# EAGLE schematic htk1087b (EAGLE 6.3)
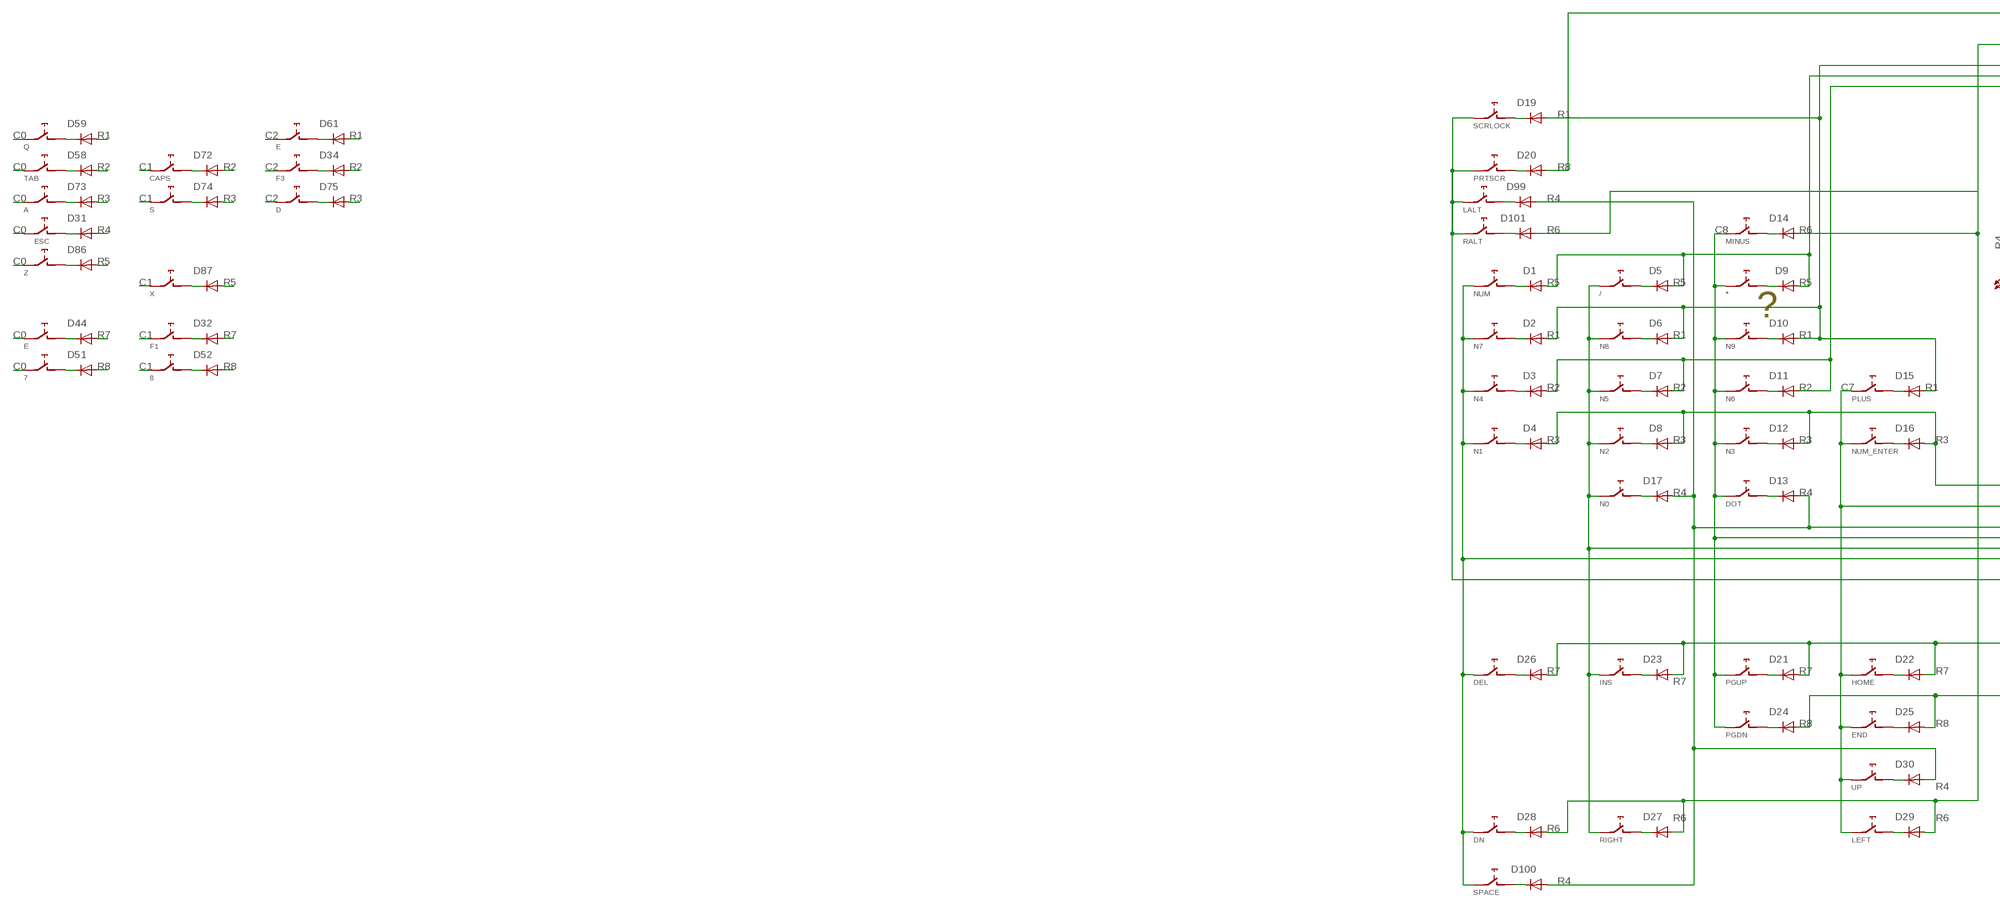
[diagram p0: schematic, sheet 1, part 1 of 2]
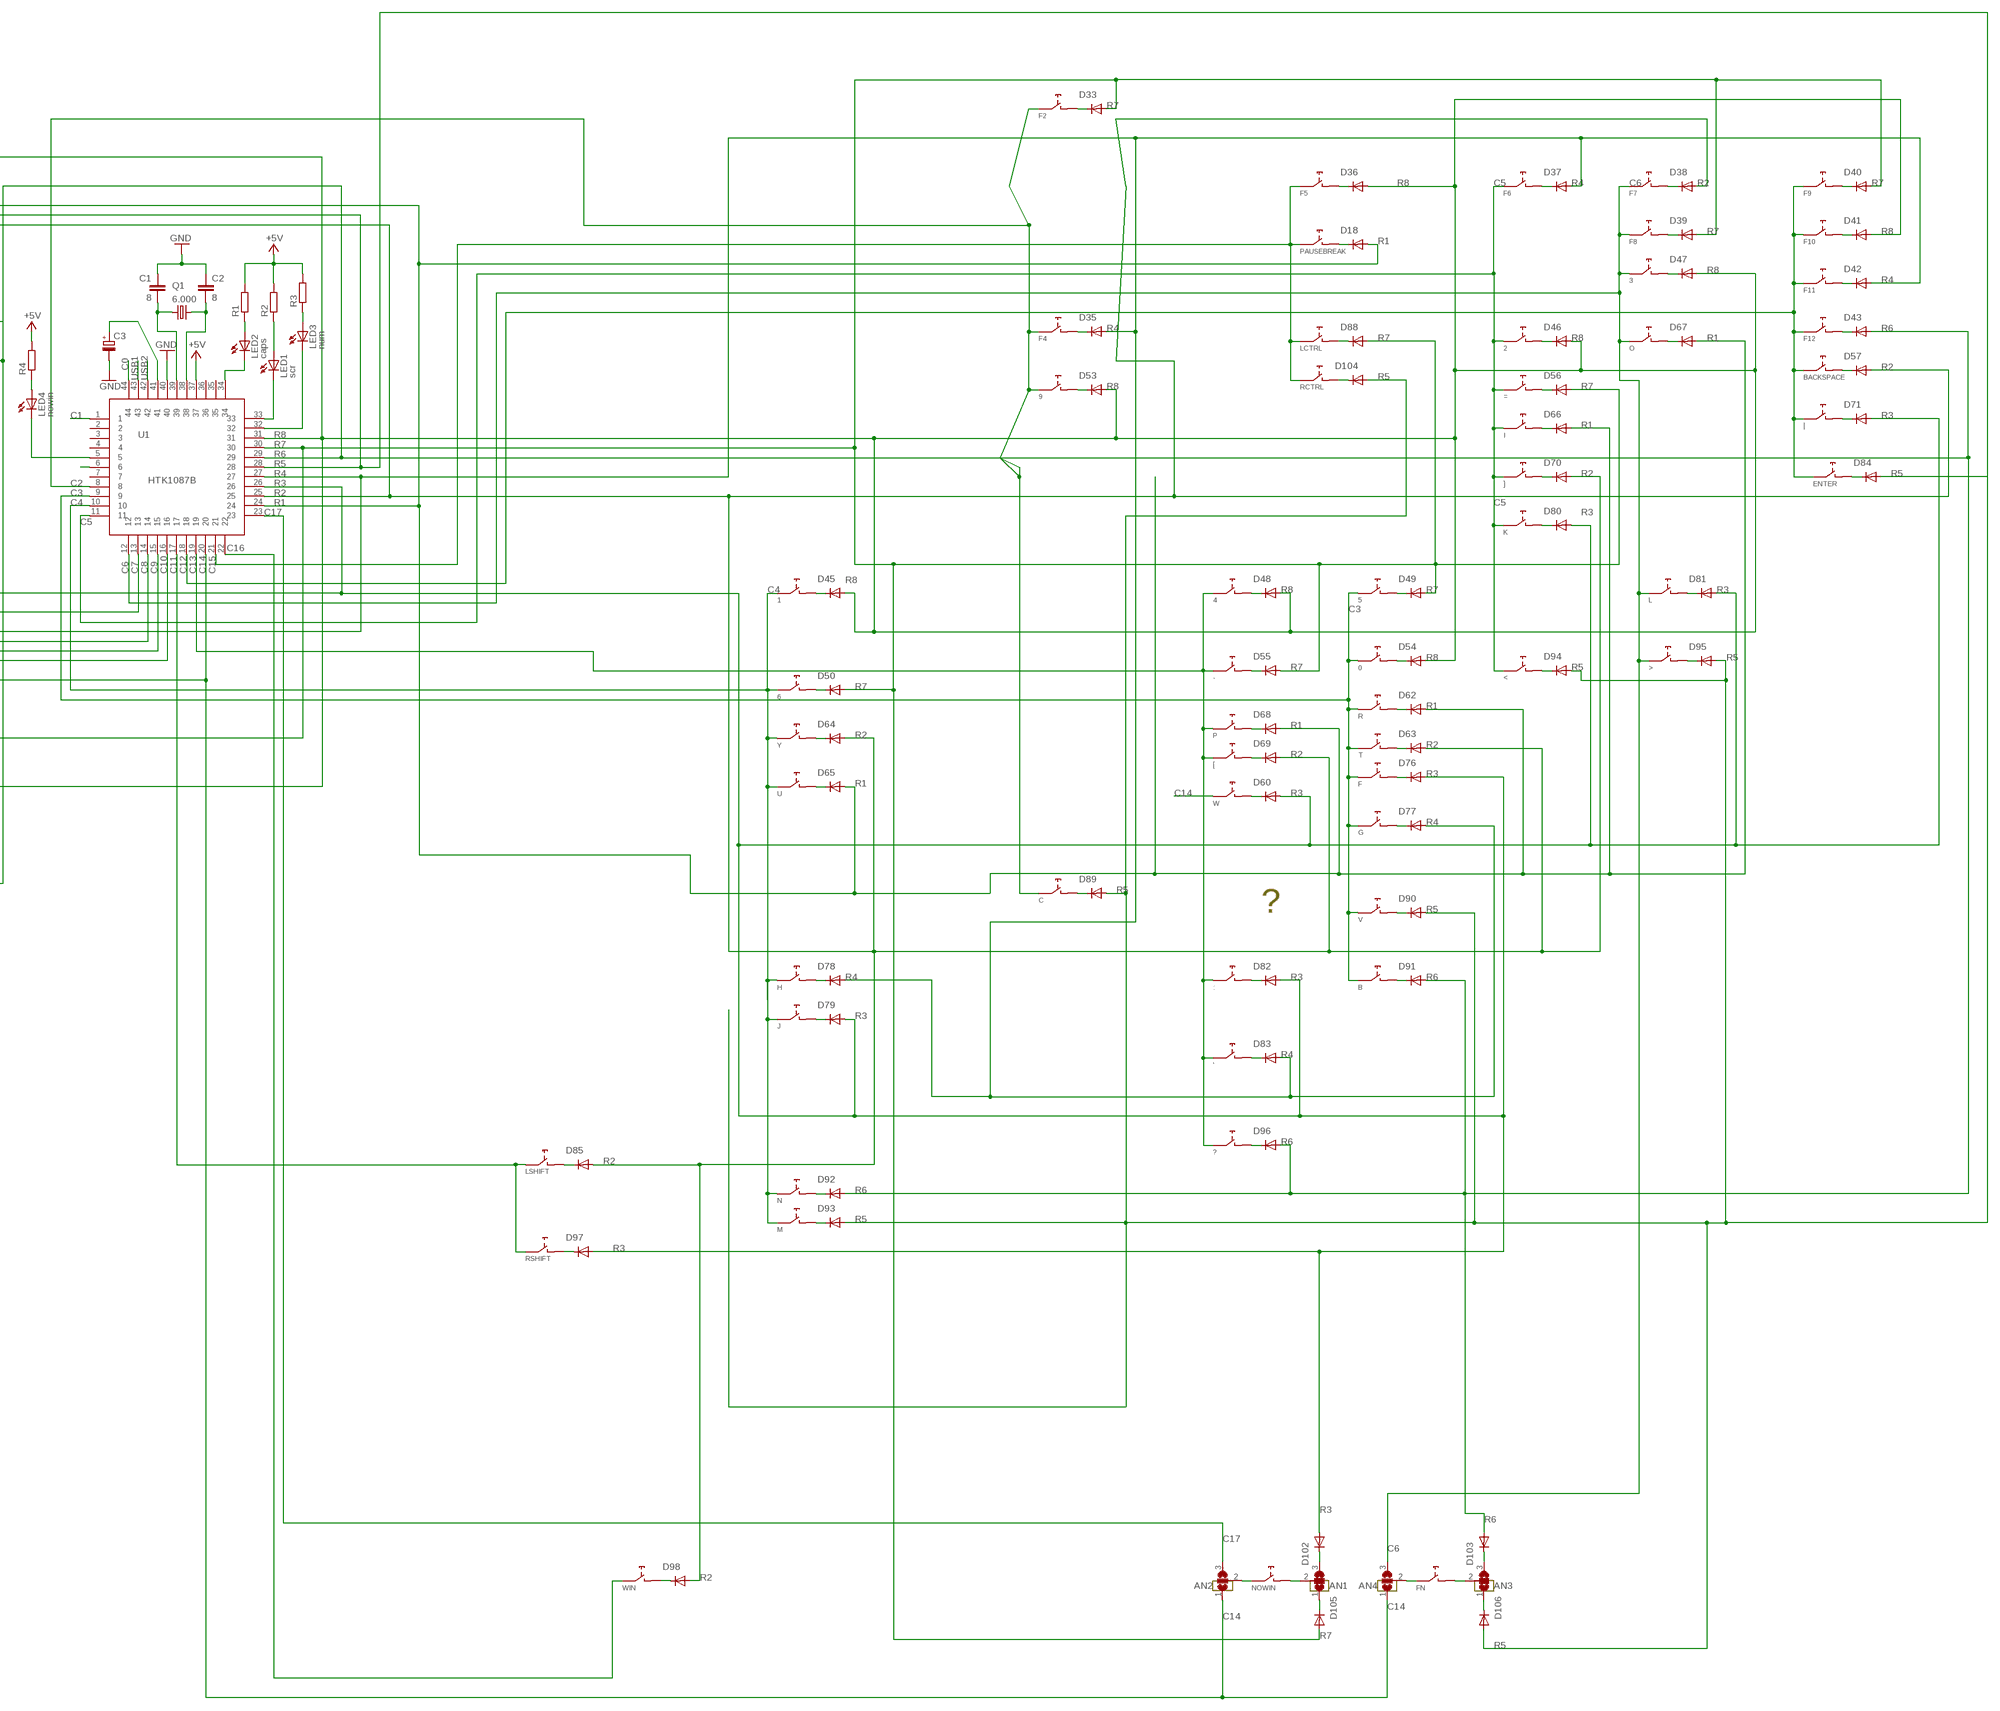
[diagram p1: schematic, sheet 1, part 2 of 2]

## Parts
0  CHERRY_MX  [CHERRY-MX]
1  CHERRY_MX  [CHERRY-MX]
2  CHERRY_MX  [CHERRY-MX]
3  CHERRY_MX  [CHERRY-MX]
4  CHERRY_MX  [CHERRY-MX]
5  CHERRY_MX  [CHERRY-MX]
6  CHERRY_MX  [CHERRY-MX]
7  CHERRY_MX  [CHERRY-MX]
8  CHERRY_MX  [CHERRY-MX]
9  CHERRY_MX  [CHERRY-MX]
'  CHERRY_MX  [CHERRY-MX]
*  CHERRY_MX  [CHERRY-MX]
-  CHERRY_MX  [CHERRY-MX]
/  CHERRY_MX  [CHERRY-MX]
:  CHERRY_MX  [CHERRY-MX]
<  CHERRY_MX  [CHERRY-MX]
=  CHERRY_MX  [CHERRY-MX]
>  CHERRY_MX  [CHERRY-MX]
?  CHERRY_MX  [CHERRY-MX]
[  CHERRY_MX  [CHERRY-MX]
]  CHERRY_MX  [CHERRY-MX]
A  CHERRY_MX  [CHERRY-MX]
AN1  SJ2W  [SJ_2]
AN2  SJ2W  [SJ_2]
AN3  SJ2W  [SJ_2]
AN4  SJ2W  [SJ_2]
B  CHERRY_MX  [CHERRY-MX]
BACKSPACE  CHERRY_MX  [CHERRY-MX]
C  CHERRY_MX  [CHERRY-MX]
C1  8  C-EU025-025X050  [C025-025X050]
C2  8  C-EU025-025X050  [C025-025X050]
C3  CPOL-EUE1.8-4  [E1,8-4]
CAPS  CHERRY_MX  [CHERRY-MX]
D  CHERRY_MX  [CHERRY-MX]
D1  1N4148DO35-7  [DO35-7]
D2  1N4148DO35-7  [DO35-7]
D3  1N4148DO35-7  [DO35-7]
D4  1N4148DO35-7  [DO35-7]
D5  1N4148DO35-7  [DO35-7]
D6  1N4148DO35-7  [DO35-7]
D7  1N4148DO35-7  [DO35-7]
D8  1N4148DO35-7  [DO35-7]
D9  1N4148DO35-7  [DO35-7]
D10  1N4148DO35-7  [DO35-7]
D11  1N4148DO35-7  [DO35-7]
D12  1N4148DO35-7  [DO35-7]
D13  1N4148DO35-7  [DO35-7]
D14  1N4148DO35-7  [DO35-7]
D15  1N4148DO35-7  [DO35-7]
D16  1N4148DO35-7  [DO35-7]
D17  1N4148DO35-7  [DO35-7]
D18  1N4148DO35-7  [DO35-7]
D19  1N4148DO35-7  [DO35-7]
D20  1N4148DO35-7  [DO35-7]
D21  1N4148DO35-7  [DO35-7]
D22  1N4148DO35-7  [DO35-7]
D23  1N4148DO35-7  [DO35-7]
D24  1N4148DO35-7  [DO35-7]
D25  1N4148DO35-7  [DO35-7]
D26  1N4148DO35-7  [DO35-7]
D27  1N4148DO35-7  [DO35-7]
D28  1N4148DO35-7  [DO35-7]
D29  1N4148DO35-7  [DO35-7]
D30  1N4148DO35-7  [DO35-7]
D31  1N4148DO35-7  [DO35-7]
D32  1N4148DO35-7  [DO35-7]
D33  1N4148DO35-7  [DO35-7]
D34  1N4148DO35-7  [DO35-7]
D35  1N4148DO35-7  [DO35-7]
D36  1N4148DO35-7  [DO35-7]
D37  1N4148DO35-7  [DO35-7]
D38  1N4148DO35-7  [DO35-7]
D39  1N4148DO35-7  [DO35-7]
D40  1N4148DO35-7  [DO35-7]
D41  1N4148DO35-7  [DO35-7]
D42  1N4148DO35-7  [DO35-7]
D43  1N4148DO35-7  [DO35-7]
D44  1N4148DO35-7  [DO35-7]
D45  1N4148DO35-7  [DO35-7]
D46  1N4148DO35-7  [DO35-7]
D47  1N4148DO35-7  [DO35-7]
D48  1N4148DO35-7  [DO35-7]
D49  1N4148DO35-7  [DO35-7]
D50  1N4148DO35-7  [DO35-7]
D51  1N4148DO35-7  [DO35-7]
D52  1N4148DO35-7  [DO35-7]
D53  1N4148DO35-7  [DO35-7]
D54  1N4148DO35-7  [DO35-7]
D55  1N4148DO35-7  [DO35-7]
D56  1N4148DO35-7  [DO35-7]
D57  1N4148DO35-7  [DO35-7]
D58  1N4148DO35-7  [DO35-7]
D59  1N4148DO35-7  [DO35-7]
D60  1N4148DO35-7  [DO35-7]
D61  1N4148DO35-7  [DO35-7]
D62  1N4148DO35-7  [DO35-7]
D63  1N4148DO35-7  [DO35-7]
D64  1N4148DO35-7  [DO35-7]
D65  1N4148DO35-7  [DO35-7]
D66  1N4148DO35-7  [DO35-7]
D67  1N4148DO35-7  [DO35-7]
D68  1N4148DO35-7  [DO35-7]
D69  1N4148DO35-7  [DO35-7]
D70  1N4148DO35-7  [DO35-7]
D71  1N4148DO35-7  [DO35-7]
D72  1N4148DO35-7  [DO35-7]
D73  1N4148DO35-7  [DO35-7]
D74  1N4148DO35-7  [DO35-7]
D75  1N4148DO35-7  [DO35-7]
D76  1N4148DO35-7  [DO35-7]
D77  1N4148DO35-7  [DO35-7]
D78  1N4148DO35-7  [DO35-7]
D79  1N4148DO35-7  [DO35-7]
D80  1N4148DO35-7  [DO35-7]
D81  1N4148DO35-7  [DO35-7]
D82  1N4148DO35-7  [DO35-7]
D83  1N4148DO35-7  [DO35-7]
D84  1N4148DO35-7  [DO35-7]
D85  1N4148DO35-7  [DO35-7]
D86  1N4148DO35-7  [DO35-7]
D87  1N4148DO35-7  [DO35-7]
D88  1N4148DO35-7  [DO35-7]
D89  1N4148DO35-7  [DO35-7]
D90  1N4148DO35-7  [DO35-7]
D91  1N4148DO35-7  [DO35-7]
D92  1N4148DO35-7  [DO35-7]
D93  1N4148DO35-7  [DO35-7]
D94  1N4148DO35-7  [DO35-7]
D95  1N4148DO35-7  [DO35-7]
D96  1N4148DO35-7  [DO35-7]
D97  1N4148DO35-7  [DO35-7]
D98  1N4148DO35-7  [DO35-7]
D99  1N4148DO35-7  [DO35-7]
D100  1N4148DO35-7  [DO35-7]
D101  1N4148DO35-7  [DO35-7]
D102  1N4148DO35-7  [DO35-7]
D103  1N4148DO35-7  [DO35-7]
D104  1N4148DO35-7  [DO35-7]
D105  1N4148DO35-7  [DO35-7]
D106  1N4148DO35-7  [DO35-7]
DEL  CHERRY_MX  [CHERRY-MX]
DN  CHERRY_MX  [CHERRY-MX]
DOT  CHERRY_MX  [CHERRY-MX]
E  CHERRY_MX  [CHERRY-MX]
END  CHERRY_MX  [CHERRY-MX]
ENTER  CHERRY_MX  [CHERRY-MX]
ESC  CHERRY_MX  [CHERRY-MX]
F  CHERRY_MX  [CHERRY-MX]
F1  CHERRY_MX  [CHERRY-MX]
F2  CHERRY_MX  [CHERRY-MX]
F3  CHERRY_MX  [CHERRY-MX]
F4  CHERRY_MX  [CHERRY-MX]
F5  CHERRY_MX  [CHERRY-MX]
F6  CHERRY_MX  [CHERRY-MX]
F7  CHERRY_MX  [CHERRY-MX]
F8  CHERRY_MX  [CHERRY-MX]
F9  CHERRY_MX  [CHERRY-MX]
F10  CHERRY_MX  [CHERRY-MX]
F11  CHERRY_MX  [CHERRY-MX]
F12  CHERRY_MX  [CHERRY-MX]
FN  CHERRY_MX  [CHERRY-MX]
G  CHERRY_MX  [CHERRY-MX]
H  CHERRY_MX  [CHERRY-MX]
HOME  CHERRY_MX  [CHERRY-MX]
I  CHERRY_MX  [CHERRY-MX]
INS  CHERRY_MX  [CHERRY-MX]
J  CHERRY_MX  [CHERRY-MX]
K  CHERRY_MX  [CHERRY-MX]
L  CHERRY_MX  [CHERRY-MX]
LALT  CHERRY_MX  [CHERRY-MX]
LCTRL  CHERRY_MX  [CHERRY-MX]
LED1  scr  TLLG4400  [LED3MM]
LED2  caps  TLLG4400  [LED3MM]
LED3  num  TLLG4400  [LED3MM]
LED4  nowin  TLLG4400  [LED3MM]
LEFT  CHERRY_MX  [CHERRY-MX]
LSHIFT  CHERRY_MX  [CHERRY-MX]
M  CHERRY_MX  [CHERRY-MX]
MINUS  CHERRY_MX  [CHERRY-MX]
N  CHERRY_MX  [CHERRY-MX]
N0  CHERRY_MX  [CHERRY-MX]
N1  CHERRY_MX  [CHERRY-MX]
N2  CHERRY_MX  [CHERRY-MX]
N3  CHERRY_MX  [CHERRY-MX]
N4  CHERRY_MX  [CHERRY-MX]
N5  CHERRY_MX  [CHERRY-MX]
N6  CHERRY_MX  [CHERRY-MX]
N7  CHERRY_MX  [CHERRY-MX]
N8  CHERRY_MX  [CHERRY-MX]
N9  CHERRY_MX  [CHERRY-MX]
NOWIN  CHERRY_MX  [CHERRY-MX]
NUM  CHERRY_MX  [CHERRY-MX]
NUM_ENTER  CHERRY_MX  [CHERRY-MX]
O  CHERRY_MX  [CHERRY-MX]
P  CHERRY_MX  [CHERRY-MX]
PAUSEBREAK  CHERRY_MX  [CHERRY-MX]
PGDN  CHERRY_MX  [CHERRY-MX]
PGUP  CHERRY_MX  [CHERRY-MX]
PLUS  CHERRY_MX  [CHERRY-MX]
PRTSCR  CHERRY_MX  [CHERRY-MX]
Q  CHERRY_MX  [CHERRY-MX]
Q1  6.000  CRYSTALHC49S  [HC49/S]
R  CHERRY_MX  [CHERRY-MX]
R1  R-EU_0207/10  [0207/10]
R2  R-EU_0207/10  [0207/10]
R3  R-EU_0207/10  [0207/10]
R4  R-EU_0207/10  [0207/10]
RALT  CHERRY_MX  [CHERRY-MX]
RCTRL  CHERRY_MX  [CHERRY-MX]
RIGHT  CHERRY_MX  [CHERRY-MX]
RSHIFT  CHERRY_MX  [CHERRY-MX]
S  CHERRY_MX  [CHERRY-MX]
SCRLOCK  CHERRY_MX  [CHERRY-MX]
SPACE  CHERRY_MX  [CHERRY-MX]
T  CHERRY_MX  [CHERRY-MX]
TAB  CHERRY_MX  [CHERRY-MX]
U  CHERRY_MX  [CHERRY-MX]
U1  HTK1087B  [TQFP44]
UP  CHERRY_MX  [CHERRY-MX]
V  CHERRY_MX  [CHERRY-MX]
W  CHERRY_MX  [CHERRY-MX]
WIN  CHERRY_MX  [CHERRY-MX]
X  CHERRY_MX  [CHERRY-MX]
Y  CHERRY_MX  [CHERRY-MX]
Z  CHERRY_MX  [CHERRY-MX]
|  CHERRY_MX  [CHERRY-MX]
Ё  CHERRY_MX  [CHERRY-MX]

## Nets
+5V: R1.2 R2.2 R3.2 R4.2 U1.37
C0: 7.SW1 A.SW1 ESC.SW1 Q.SW1 TAB.SW1 U1.44 Z.SW1 Ё.SW1
C1: 8.SW1 CAPS.SW1 F1.SW1 S.SW1 U1.1 X.SW1
C2: 9.SW1 C.SW1 D.SW1 E.SW1 F2.SW1 F3.SW1 F4.SW1 U1.8
C3: 0.SW1 5.SW1 B.SW1 F.SW1 G.SW1 R.SW1 T.SW1 U1.9 V.SW1
C4: 1.SW1 6.SW1 H.SW1 J.SW1 M.SW1 N.SW1 U1.10 U.SW1 Y.SW1
C5: 2.SW1 <.SW1 =.SW1 ].SW1 F6.SW1 I.SW1 K.SW1 U1.11
C6: 3.SW1 >.SW1 AN4.3 F7.SW1 F8.SW1 L.SW1 O.SW1 U1.12
C7: END.SW1 HOME.SW1 LEFT.SW1 NUM_ENTER.SW1 PLUS.SW1 U1.13 UP.SW1
C8: *.SW1 DOT.SW1 MINUS.SW1 N3.SW1 N6.SW1 N9.SW1 PGDN.SW1 PGUP.SW1 U1.14
C9: /.SW1 INS.SW1 N0.SW1 N2.SW1 N5.SW1 N8.SW1 RIGHT.SW1 U1.15
C10: DEL.SW1 DN.SW1 N1.SW1 N4.SW1 N7.SW1 NUM.SW1 SPACE.SW1 U1.16
C11: LSHIFT.SW1 RSHIFT.SW1 U1.17
C12: BACKSPACE.SW1 ENTER.SW1 F9.SW1 F10.SW1 F11.SW1 F12.SW1 U1.18 |.SW1
C13: 4.SW1 '.SW1 -.SW1 :.SW1 ?.SW1 [.SW1 P.SW1 U1.19
C14: AN2.1 AN4.1 LALT.SW1 PRTSCR.SW1 RALT.SW1 SCRLOCK.SW1 U1.20 W.SW1
C15: F5.SW1 LCTRL.SW1 PAUSEBREAK.SW1 RCTRL.SW1 U1.21
C16: U1.22 WIN.SW1
C17: AN2.3 U1.23
GND: C1.1 C2.1 C3.- U1.40
N$1: C1.2 Q1.1 U1.39
N$2: C2.2 Q1.2 U1.38
N$7: D4.C N1.SW2
N$8: D3.C N4.SW2
N$9: D2.C N7.SW2
N$10: D1.C NUM.SW2
N$11: D13.C DOT.SW2
N$12: D12.C N3.SW2
N$13: D11.C N6.SW2
N$14: D10.C N9.SW2
N$15: *.SW2 D9.C
N$16: /.SW2 D5.C
N$17: D6.C N8.SW2
N$18: D7.C N5.SW2
N$19: D8.C N2.SW2
N$20: D16.C NUM_ENTER.SW2
N$21: D15.C PLUS.SW2
N$22: D14.C MINUS.SW2
N$25: D20.C PRTSCR.SW2
N$26: D17.C N0.SW2
N$28: D19.C SCRLOCK.SW2
N$29: D18.C PAUSEBREAK.SW2
N$35: AN3.1 D106.C
N$36: D23.C INS.SW2
N$37: D22.C HOME.SW2
N$38: D21.C PGUP.SW2
N$39: D26.C DEL.SW2
N$40: D25.C END.SW2
N$41: D24.C PGDN.SW2
N$42: D29.C LEFT.SW2
N$43: D28.C DN.SW2
N$44: D27.C RIGHT.SW2
N$45: D30.C UP.SW2
N$47: D31.C ESC.SW2
N$48: D59.C Q.SW2
N$49: D32.C F1.SW2
N$50: D44.C Ё.SW2
N$51: D33.C F2.SW2
N$52: D58.C TAB.SW2
N$53: D34.C F3.SW2
N$54: 1.SW2 D45.C
N$55: D35.C F4.SW2
N$56: D60.C W.SW2
N$57: D36.C F5.SW2
N$58: 2.SW2 D46.C
N$59: D37.C F6.SW2
N$60: D61.C E.SW2
N$61: D38.C F7.SW2
N$62: 3.SW2 D47.C
N$63: D39.C F8.SW2
N$64: D62.C R.SW2
N$65: D40.C F9.SW2
N$66: 4.SW2 D48.C
N$67: D41.C F10.SW2
N$69: D42.C F11.SW2
N$70: 5.SW2 D49.C
N$71: D43.C F12.SW2
N$78: 6.SW2 D50.C
N$80: D63.C T.SW2
N$81: 7.SW2 D51.C
N$82: D64.C Y.SW2
N$83: 8.SW2 D52.C
N$84: D65.C U.SW2
N$85: 9.SW2 D53.C
N$86: D66.C I.SW2
N$87: 0.SW2 D54.C
N$89: -.SW2 D55.C
N$90: D67.C O.SW2
N$91: =.SW2 D56.C
N$92: D68.C P.SW2
N$93: BACKSPACE.SW2 D57.C
N$94: [.SW2 D69.C
N$95: ].SW2 D70.C
N$96: D71.C |.SW2
N$97: A.SW2 D73.C
N$98: D74.C S.SW2
N$99: CAPS.SW2 D72.C
N$100: D75.C D.SW2
N$101: D76.C F.SW2
N$102: D77.C G.SW2
N$103: D78.C H.SW2
N$104: D79.C J.SW2
N$105: D80.C K.SW2
N$106: D81.C L.SW2
N$107: :.SW2 D82.C
N$108: '.SW2 D83.C
N$109: D84.C ENTER.SW2
N$111: D98.C WIN.SW2
N$112: D88.C LCTRL.SW2
N$113: D99.C LALT.SW2
N$114: D100.C SPACE.SW2
N$115: D101.C RALT.SW2
N$116: AN2.2 NOWIN.SW1
N$117: AN1.2 NOWIN.SW2
N$118: D104.C RCTRL.SW2
N$120: AN4.2 FN.SW1
N$121: AN3.2 FN.SW2
N$122: AN3.3 D103.C
N$124: AN1.3 D102.C
N$127: AN1.1 D105.C
N$128: D85.C LSHIFT.SW2
N$129: D86.C Z.SW2
N$130: D87.C X.SW2
N$131: C.SW2 D89.C
N$132: D90.C V.SW2
N$133: B.SW2 D91.C
N$134: D92.C N.SW2
N$135: D93.C M.SW2
N$136: <.SW2 D94.C
N$137: >.SW2 D95.C
N$138: ?.SW2 D96.C
N$139: D97.C RSHIFT.SW2
N$140: C3.+ U1.41
N$142: LED4.K(C) U1.5
N$143: U1.6
N$145: LED1.K(C) U1.33
N$146: LED2.K(C) U1.34
N$147: LED3.K(C) U1.32
N$148: LED2.A R1.1
N$149: LED1.A R2.1
N$150: LED3.A R3.1
N$152: LED4.A R4.1
R1: D2.A D6.A D10.A D15.A D18.A D19.A D59.A D61.A D62.A D65.A D66.A D67.A D68.A U1.24
R2: D3.A D7.A D11.A D34.A D38.A D57.A D58.A D63.A D64.A D69.A D70.A D72.A D85.A D98.A U1.25
R3: D4.A D8.A D12.A D16.A D60.A D71.A D73.A D74.A D75.A D76.A D79.A D80.A D81.A D82.A D97.A D102.A U1.26
R4: D13.A D17.A D30.A D31.A D35.A D37.A D42.A D77.A D78.A D83.A D99.A D100.A U1.27
R5: D1.A D5.A D9.A D84.A D86.A D87.A D89.A D90.A D93.A D94.A D95.A D104.A D106.A U1.28
R6: D14.A D27.A D28.A D29.A D43.A D91.A D92.A D96.A D101.A D103.A U1.29
R7: D21.A D22.A D23.A D26.A D32.A D33.A D39.A D40.A D44.A D49.A D50.A D55.A D56.A D88.A D105.A U1.30
R8: D20.A D24.A D25.A D36.A D41.A D45.A D46.A D47.A D48.A D51.A D52.A D53.A D54.A U1.31
USB1: U1.43
USB2: U1.42
Unconnected: U1.2 U1.3 U1.4 U1.7 U1.35 U1.36

## Notes on the sheet
- ?
- ?

## Library data of the parts
0 1-9 ' * - / : < = > ? [ ] A B BACKSPACE C CAPS D DEL DN DOT E END ENTER ESC F F1-F12 FN G H HOME I INS J K L LALT LCTRL LEFT LSHIFT M MINUS N N0 N1-N9 NOWIN NUM NUM_ENTER O P PAUSEBREAK PGDN PGUP PLUS PRTSCR Q R RALT RCTRL RIGHT RSHIFT S SCRLOCK SPACE T TAB U UP V W WIN X Y Z | Ё = cherrymx:CHERRY_MX
AN1-AN4 = jumper:SJ2W: SMD solder JUMPER
C1 C2 = rcl:C-EU: CAPACITOR, European symbol
C3 = rcl:CPOL-EU: POLARIZED CAPACITOR, European symbol
D1-D106 = diode:1N4148: DIODE high speed (Philips)
LED1-LED4 = led:TLLG4400: Low Current (2mA) LED 3 mm Tinted Diffused Package color GREEN Source: Data sheet <http://www.farnell.com/datasheets/391098.pdf>; MF: VISHAY SEMICONDUCTOR; OC_FARNELL: 1612435
Q1 = crystal:CRYSTAL: CRYSTAL; OC_FARNELL: 1667008; OC_NEWARK: unknown
R1-R4 = rcl:R-EU_: RESISTOR, European symbol
U1 = htk1087b:HTK1087B